# Altium project LED_Bord.PrjPcb
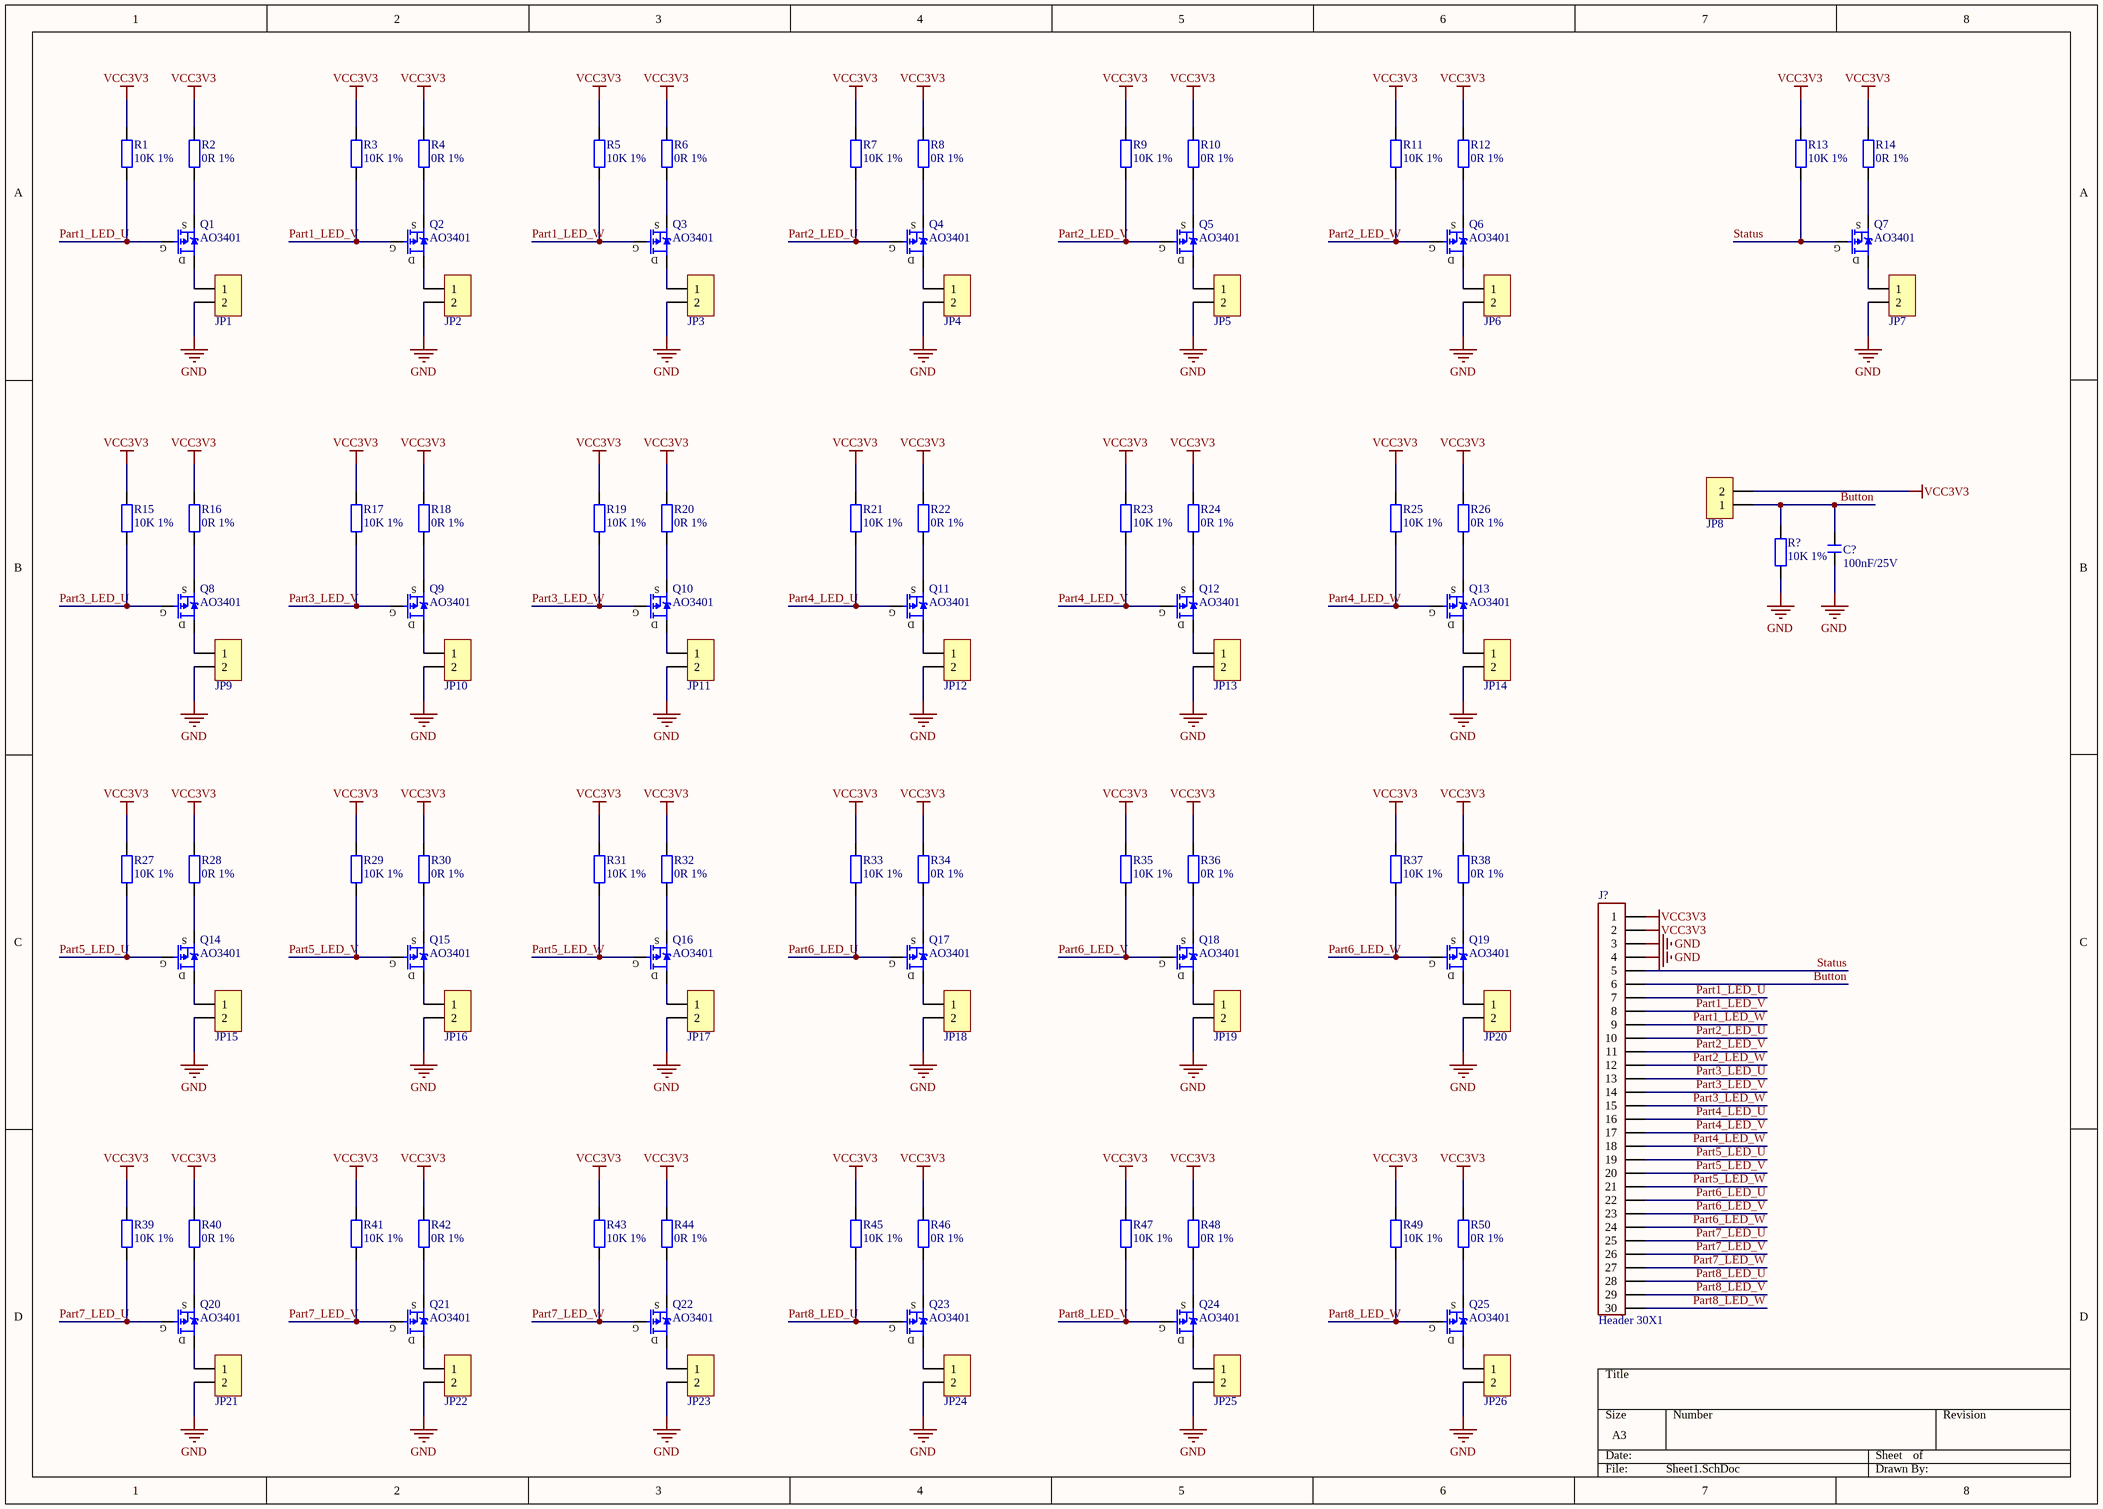
[diagram p0: Sheet1.SchDoc]
1 sheet, 104 parts. Net scope: global (net labels, ports and power ports of the same name join across sheets).
Board file: PCB1.PcbDoc

## Sheet Sheet1.SchDoc
size A3; SheetNumber: 1; SheetTotal: 1

### Parts
C?  100nF/25V  [C0603_L]
J?  Header 30X1  [FPC1.0-2H-WS-30P]
JP1  HDR-1X2  [LED 5MM-R]  (value not drawn)
JP2  HDR-1X2  [LED 5MM-R]  (value not drawn)
JP3  HDR-1X2  [LED 5MM-R]  (value not drawn)
JP4  HDR-1X2  [LED 5MM-R]  (value not drawn)
JP5  HDR-1X2  [LED 5MM-R]  (value not drawn)
JP6  HDR-1X2  [LED 5MM-R]  (value not drawn)
JP7  HDR-1X2  [LED 5MM-G]  (value not drawn)
JP8  HDR-1X2  [XH2.54-WS-2P]  (value not drawn)
JP9  HDR-1X2  [LED 5MM-R]  (value not drawn)
JP10  HDR-1X2  [LED 5MM-R]  (value not drawn)
JP11  HDR-1X2  [LED 5MM-R]  (value not drawn)
JP12  HDR-1X2  [LED 5MM-R]  (value not drawn)
JP13  HDR-1X2  [LED 5MM-R]  (value not drawn)
JP14  HDR-1X2  [LED 5MM-R]  (value not drawn)
JP15  HDR-1X2  [LED 5MM-R]  (value not drawn)
JP16  HDR-1X2  [LED 5MM-R]  (value not drawn)
JP17  HDR-1X2  [LED 5MM-R]  (value not drawn)
JP18  HDR-1X2  [LED 5MM-R]  (value not drawn)
JP19  HDR-1X2  [LED 5MM-R]  (value not drawn)
JP20  HDR-1X2  [LED 5MM-R]  (value not drawn)
JP21  HDR-1X2  [LED 5MM-R]  (value not drawn)
JP22  HDR-1X2  [LED 5MM-R]  (value not drawn)
JP23  HDR-1X2  [LED 5MM-R]  (value not drawn)
JP24  HDR-1X2  [LED 5MM-R]  (value not drawn)
JP25  HDR-1X2  [LED 5MM-R]  (value not drawn)
JP26  HDR-1X2  [LED 5MM-R]  (value not drawn)
Q1  AO3401  [SOT23-3L]
Q2  AO3401  [SOT23-3L]
Q3  AO3401  [SOT23-3L]
Q4  AO3401  [SOT23-3L]
Q5  AO3401  [SOT23-3L]
Q6  AO3401  [SOT23-3L]
Q7  AO3401  [SOT23-3L]
Q8  AO3401  [SOT23-3L]
Q9  AO3401  [SOT23-3L]
Q10  AO3401  [SOT23-3L]
Q11  AO3401  [SOT23-3L]
Q12  AO3401  [SOT23-3L]
Q13  AO3401  [SOT23-3L]
Q14  AO3401  [SOT23-3L]
Q15  AO3401  [SOT23-3L]
Q16  AO3401  [SOT23-3L]
Q17  AO3401  [SOT23-3L]
Q18  AO3401  [SOT23-3L]
Q19  AO3401  [SOT23-3L]
Q20  AO3401  [SOT23-3L]
Q21  AO3401  [SOT23-3L]
Q22  AO3401  [SOT23-3L]
Q23  AO3401  [SOT23-3L]
Q24  AO3401  [SOT23-3L]
Q25  AO3401  [SOT23-3L]
R1  10K 1%  [R0603_L]
R2  0R 1%  [R0603_L]
R3  10K 1%  [R0603_L]
R4  0R 1%  [R0603_L]
R5  10K 1%  [R0603_L]
R6  0R 1%  [R0603_L]
R7  10K 1%  [R0603_L]
R8  0R 1%  [R0603_L]
R9  10K 1%  [R0603_L]
R10  0R 1%  [R0603_L]
R11  10K 1%  [R0603_L]
R12  0R 1%  [R0603_L]
R13  10K 1%  [R0603_L]
R14  0R 1%  [R0603_L]
R15  10K 1%  [R0603_L]
R16  0R 1%  [R0603_L]
R17  10K 1%  [R0603_L]
R18  0R 1%  [R0603_L]
R19  10K 1%  [R0603_L]
R20  0R 1%  [R0603_L]
R21  10K 1%  [R0603_L]
R22  0R 1%  [R0603_L]
R23  10K 1%  [R0603_L]
R24  0R 1%  [R0603_L]
R25  10K 1%  [R0603_L]
R26  0R 1%  [R0603_L]
R27  10K 1%  [R0603_L]
R28  0R 1%  [R0603_L]
R29  10K 1%  [R0603_L]
R30  0R 1%  [R0603_L]
R31  10K 1%  [R0603_L]
R32  0R 1%  [R0603_L]
R33  10K 1%  [R0603_L]
R34  0R 1%  [R0603_L]
R35  10K 1%  [R0603_L]
R36  0R 1%  [R0603_L]
R37  10K 1%  [R0603_L]
R38  0R 1%  [R0603_L]
R39  10K 1%  [R0603_L]
R40  0R 1%  [R0603_L]
R41  10K 1%  [R0603_L]
R42  0R 1%  [R0603_L]
R43  10K 1%  [R0603_L]
R44  0R 1%  [R0603_L]
R45  10K 1%  [R0603_L]
R46  0R 1%  [R0603_L]
R47  10K 1%  [R0603_L]
R48  0R 1%  [R0603_L]
R49  10K 1%  [R0603_L]
R50  0R 1%  [R0603_L]
R?  10K 1%  [R0603_L]

### Nets
GND: C?.2 J?.3 J?.4 JP1.2 JP2.2 JP3.2 JP4.2 JP5.2 JP6.2 JP7.2 JP9.2 JP10.2 JP11.2 JP12.2 JP13.2 JP14.2 JP15.2 JP16.2 JP17.2 JP18.2 JP19.2 JP20.2 JP21.2 JP22.2 JP23.2 JP24.2 JP25.2 JP26.2 R?.1
VCC3V3: J?.1 J?.2 JP8.2 R1.2 R2.2 R3.2 R4.2 R5.2 R6.2 R7.2 R8.2 R9.2 R10.2 R11.2 R12.2 R13.2 R14.2 R15.2 R16.2 R17.2 R18.2 R19.2 R20.2 R21.2 R22.2 R23.2 R24.2 R25.2 R26.2 R27.2 R28.2 R29.2 R30.2 R31.2 R32.2 R33.2 R34.2 R35.2 R36.2 R37.2 R38.2 R39.2 R40.2 R41.2 R42.2 R43.2 R44.2 R45.2 R46.2 R47.2 R48.2 R49.2 R50.2
Button: C?.1 J?.6 JP8.1 R?.2
Part1_LED_U: J?.7 Q1.1(G) R1.1
Part1_LED_V: J?.8 Q2.1(G) R3.1
Part1_LED_W: J?.9 Q3.1(G) R5.1
Part2_LED_U: J?.10 Q4.1(G) R7.1
Part2_LED_V: J?.11 Q5.1(G) R9.1
Part2_LED_W: J?.12 Q6.1(G) R11.1
Part3_LED_U: J?.13 Q8.1(G) R15.1
Part3_LED_V: J?.14 Q9.1(G) R17.1
Part3_LED_W: J?.15 Q10.1(G) R19.1
Part4_LED_U: J?.16 Q11.1(G) R21.1
Part4_LED_V: J?.17 Q12.1(G) R23.1
Part4_LED_W: J?.18 Q13.1(G) R25.1
Part5_LED_U: J?.19 Q14.1(G) R27.1
Part5_LED_V: J?.20 Q15.1(G) R29.1
Part5_LED_W: J?.21 Q16.1(G) R31.1
Part6_LED_U: J?.22 Q17.1(G) R33.1
Part6_LED_V: J?.23 Q18.1(G) R35.1
Part6_LED_W: J?.24 Q19.1(G) R37.1
Part7_LED_U: J?.25 Q20.1(G) R39.1
Part7_LED_V: J?.26 Q21.1(G) R41.1
Part7_LED_W: J?.27 Q22.1(G) R43.1
Part8_LED_U: J?.28 Q23.1(G) R45.1
Part8_LED_V: J?.29 Q24.1(G) R47.1
Part8_LED_W: J?.30 Q25.1(G) R49.1
Status: J?.5 Q7.1(G) R13.1
NetJP1_1: JP1.1 Q1.3(D)
NetJP2_1: JP2.1 Q2.3(D)
NetJP3_1: JP3.1 Q3.3(D)
NetJP4_1: JP4.1 Q4.3(D)
NetJP5_1: JP5.1 Q5.3(D)
NetJP6_1: JP6.1 Q6.3(D)
NetJP7_1: JP7.1 Q7.3(D)
NetJP9_1: JP9.1 Q8.3(D)
NetJP10_1: JP10.1 Q9.3(D)
NetJP11_1: JP11.1 Q10.3(D)
NetJP12_1: JP12.1 Q11.3(D)
NetJP13_1: JP13.1 Q12.3(D)
NetJP14_1: JP14.1 Q13.3(D)
NetJP15_1: JP15.1 Q14.3(D)
NetJP16_1: JP16.1 Q15.3(D)
NetJP17_1: JP17.1 Q16.3(D)
NetJP18_1: JP18.1 Q17.3(D)
NetJP19_1: JP19.1 Q18.3(D)
NetJP20_1: JP20.1 Q19.3(D)
NetJP21_1: JP21.1 Q20.3(D)
NetJP22_1: JP22.1 Q21.3(D)
NetJP23_1: JP23.1 Q22.3(D)
NetJP24_1: JP24.1 Q23.3(D)
NetJP25_1: JP25.1 Q24.3(D)
NetJP26_1: JP26.1 Q25.3(D)
NetQ1_2: Q1.2(S) R2.1
NetQ2_2: Q2.2(S) R4.1
NetQ3_2: Q3.2(S) R6.1
NetQ4_2: Q4.2(S) R8.1
NetQ5_2: Q5.2(S) R10.1
NetQ6_2: Q6.2(S) R12.1
NetQ7_2: Q7.2(S) R14.1
NetQ8_2: Q8.2(S) R16.1
NetQ9_2: Q9.2(S) R18.1
NetQ10_2: Q10.2(S) R20.1
NetQ11_2: Q11.2(S) R22.1
NetQ12_2: Q12.2(S) R24.1
NetQ13_2: Q13.2(S) R26.1
NetQ14_2: Q14.2(S) R28.1
NetQ15_2: Q15.2(S) R30.1
NetQ16_2: Q16.2(S) R32.1
NetQ17_2: Q17.2(S) R34.1
NetQ18_2: Q18.2(S) R36.1
NetQ19_2: Q19.2(S) R38.1
NetQ20_2: Q20.2(S) R40.1
NetQ21_2: Q21.2(S) R42.1
NetQ22_2: Q22.2(S) R44.1
NetQ23_2: Q23.2(S) R46.1
NetQ24_2: Q24.2(S) R48.1
NetQ25_2: Q25.2(S) R50.1

### Library data of the parts
C? = C: 无极性贴片电容; 版权归属: 源创客; 材质: X7R; BOM名称: 无极性贴片电容; 学习资源: www.ooocke.com
JP1-JP26 = Header 2: 2P接插件; 版权归属: 源创客; BOM名称: 2P接插件; 学习资源: www.ooocke.com
Q1-Q25 = AO3401: P沟道 30V/4.2A; BOM名称: 场效应管; 版权归属: 源创客; 学习资源: www.ooocke.com; 描述: P沟道 30V/4.2A
R1-R50 R? = R: 贴片电阻; 版权归属: 源创客; BOM名称: 贴片电阻; 学习资源: www.ooocke.com